# EAGLE design heartrate (EAGLE 7.4.0)
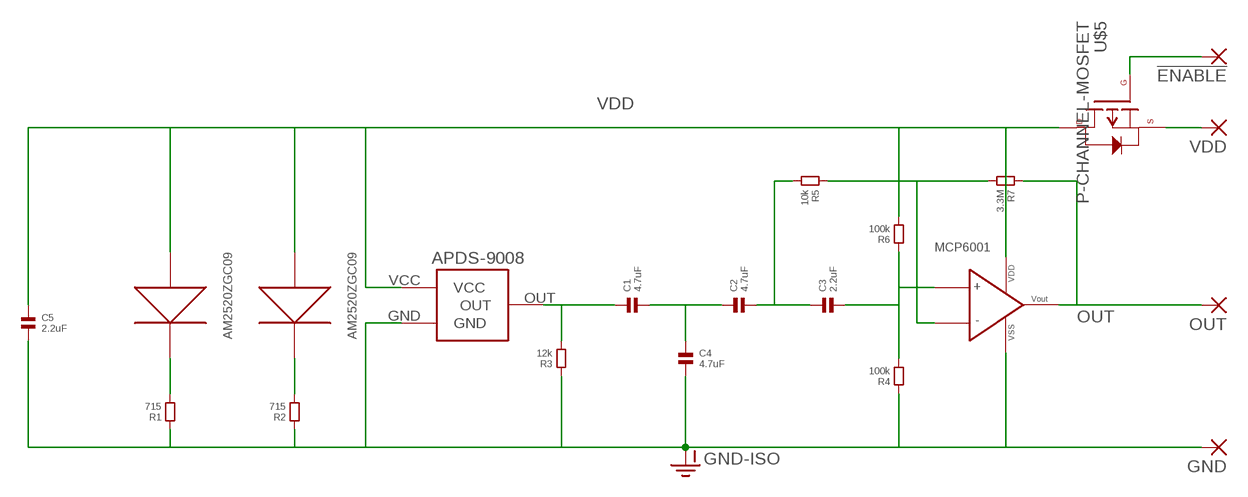
[diagram p0: schematic, sheet 1]

## Parts
!ENABLE  SMD2  [SMD1,27-2,54]
C1  4.7uF  CAPACITOR.0402  [0402]
C2  4.7uF  CAPACITOR.0402  [0402]
C3  2.2uF  CAPACITOR.0402  [0402]
C4  4.7uF  CAPACITOR.0402  [0402]
C5  2.2uF  CAPACITOR.0402  [0402]
GND  SMD2  [SMD1,27-2,54]
OUT  SMD2  [SMD1,27-2,54]
R1  715  RESISTOR.0402  [0402]
R2  715  RESISTOR.0402  [0402]
R3  12k  RESISTOR.0402  [0402]
R4  100k  RESISTOR.0402  [0402]
R5  10k  RESISTOR.0402  [0402]
R6  100k  RESISTOR.0402  [0402]
R7  3.3M  RESISTOR.0402  [0402]
U$1  DSAH3717  [DSAH3717]
U$2  DSAH3717  [DSAH3717]
U$3  APDS-9008  [APDS-9008]
U$4  MCP6001  [SOT23-5]
U$5  P-CHANNEL-MOSFET  [SOT23-3]
VDD  SMD2  [SMD1,27-2,54]

## Nets
GND: C4.2 C5.2 GND.1(P) R1.1 R2.1 R3.1 R4.1 U$3.GND U$4.VSS ; supply symbol labelled GND-ISO
N$1: R1.2 U$1.G(GND)
N$2: U$5.2(S) VDD.1(P)
N$3: !ENABLE.1(P) U$5.1(G)
N$4: R2.2 U$2.G(GND)
N$5: C1.1 R3.2 U$3.OUT
N$6: C1.2 C2.1 C4.1
N$7: C2.2 C3.1 R5.2
N$10: C3.2 R4.2 R6.1 U$4.VIN+
N$12: R5.1 R7.2 U$4.VIN-
OUT: OUT.1(P) R7.1 U$4.VOUT
VDD: C5.1 R6.2 U$1.V(VDD) U$2.V(VDD) U$3.VCC U$4.VDD U$5.3(D)

## Library data of the parts
!ENABLE GND OUT VDD = wirepad:SMD2: SMD PAD
C1-C5 = standardparts:CAPACITOR
R1-R7 = standardparts:RESISTOR
U$1 U$2 = MedStatCustom:DSAH3717
U$3 = MedStatCustom:APDS-9008
U$4 = MedStatCustom:MCP6001
U$5 = GeekAmmo:P-CHANNEL-MOSFET: P-Channel MOSFET Mode Field Effect Transistor

## Board
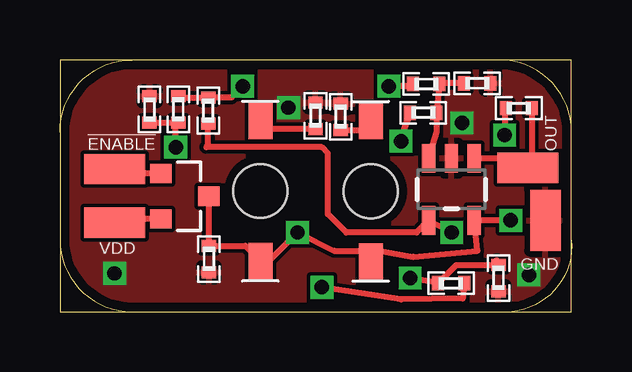
[diagram p1: board, top side]
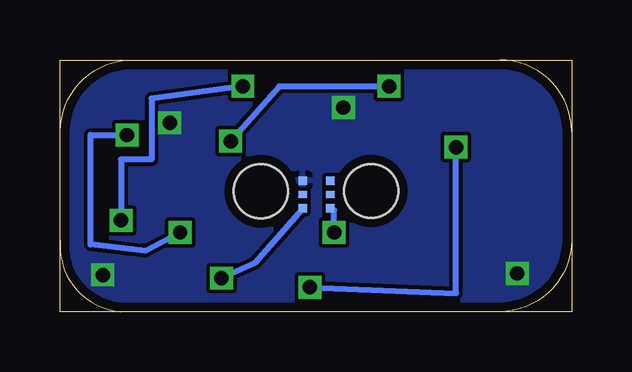
[diagram p2: board, bottom side, seen from below]

Size 21.34 x 10.5 mm. Coordinates in mm from the lower left corner, seen from the top.
Outline: 3,0 0,0 0,3
Outline: 3,0 18.84,0
Outline: 18.84,0 21.33,0 21.33,3
Outline: 21.33,3 21.33,7.5
Outline: 21.33,7.5 21.33,10.5 18.33,10.5
Outline: 18.33,10.5 3,10.5
Outline: 3,10.5 0,10.5 0,7.5
Outline: 0,7.5 0,3
Outline: 2.1,10.5 2,10.5
Outline: 0,3 arc90 3,0
Outline: 21.33,3 arc-90 18.84,0
Outline: 21.33,7.5 arc90 18.33,10.5
Outline: 0,7.5 arc-90 3,10.5
Copper layers (1*16): Top 0.0356mm / dielectric 1.5011mm / Bottom 0.0356mm
Design rules "oshpark-2layer": minimum track width 6mil, minimum drill 13mil, track to track 6mil, track to pad 6mil, pad to pad 6mil, via to via 6mil, smd to smd 6mil, copper to edge 15mil, drill to drill 6mil, minimum pad ring 7mil, minimum via ring 7mil, stop-mask expansion 4mil, vias tented up to drill 0mil, thermal gap 10mil

### Footprints (pad centres in the part's own frame; a part is rotated, then mirrored left to right if it is on the bottom)
SMD1,27-2,54 = smd 1.27 x 2.54: 1 0,0
0402 = smd 0.5 x 0.6: 1 -0.55,0; 2 0.55,0
DSAH3717 = smd 1.5 x 1: G 2.925,0; V -2.925,0 | hole 2.25: 0,0
APDS-9008 = smd 0.35 x 0.35: GND -0.575,-0.575; OUT 0.575,-0.575; P$6 -0.575,0.575; VCC 0.575,0.575 | smd 0.3 x 0.35: P$1 0,0.575; P$2 0,-0.575
SOT23-5 = smd 0.55 x 1.2: VDD -0.95,1.3; VIN+ 0.95,-1.3; VIN- 0.95,1.3; VOUT -0.95,-1.3; VSS 0,-1.3
SOT23-3 = smd 0.8 x 0.9: 1 -0.95,-1; 2 0.95,-1; 3 0,1

### Placement (x,y rotation side)
!ENABLE  2.28,5.95 270 top
C1  16.3,1.18 0 top
C2  4.93,8.44 90 top
C3  15.15,8.3 0 top
C4  3.73,8.44 90 top
C5  6.21,2.19 270 top
GND  20.24,3.8 180 top
OUT  19.52,5.99 90 top
R1  11.7,8.13 270 top
R2  10.66,8.17 270 top
R3  18.29,1.4 90 top
R4  17.4,9.53 180 top
R5  6.18,8.39 90 top
R6  15.28,9.5 180 top
R7  19.13,8.49 180 top
U$1  12.96,5.02 90 top
U$2  8.36,5.03 90 top
U$3  10.64,4.89 270 bottom
U$4  16.32,5.1 180 top
U$5  5.2,4.81 270 top
VDD  2.28,3.71 90 top

### Tracks (layer width: path | path; a pad name or v marks a point on that pad's centre or on a via)
GND  (via drill 0.6)
  other vias: 2.28,1.59 19.56,1.52 9.53,8.51 16.76,7.87
  pour Top: -0.4,10.8 -0.4,-0.6 23,-0.6 23,10.8
  pour Bottom: -0.7,11.3 23.5,11.3 23.5,-1.1 -0.7,-1.1
N$1
  Top 0.254: R1.2 12.96,7.58 U$1.G
N$2
  Top 0.254: U$5.2 2.28,3.86 VDD.1
N$3
  Top 0.254: U$5.1 2.28,5.76 !ENABLE.1
N$4
  Top 0.254: R2.2 8.36,7.62 U$2.G
N$5  (via drill 0.6)
  Top 0.254: v14.61,1.4 15.54,1.27 C1.1 16.52,1.95 R3.2 18.21,2.15
  Bottom 0.254: U$3.OUT 11.22,4.28 13.21,2.03 v14.61,1.4
N$6  (via drill 0.6)
  Top 0.254: C4.1 C2.1 4.83,7.78 v4.83,6.86 | C1.2 16.8,0.54 14.22,0.51 v10.92,1.02
  Bottom 0.254: v10.92,1.02 4.83,0.76 v4.83,6.86
N$7  (via drill 0.6)
  Top 0.254: C2.2 4.99,8.94 R5.2 7.16,8.94 v7.62,9.4 | C3.1 14.34,7.62 v14.22,7.11
  Bottom 0.254: v14.22,7.11 12.19,9.4 v7.62,9.4
N$10
  Top 0.254: R4.2 15.72,9.53 R6.1 C3.2 15.7,7.48 U$4.VIN+
N$12  (via drill 0.6)
  Top 0.254: R7.2 18.54,8.23 v18.54,7.37 | v16.33,3.3 U$4.VIN- | U$4.VIN- | U$4.VIN- 14.87,3.3 11.94,3.3 11.18,4.06 11.18,6.6 10.92,6.86 6.1,6.86 6.18,6.94 R5.1
  Bottom 0.254: v16.33,3.3 17.78,2.54 20.07,2.79 20.07,7.37 v18.54,7.37
OUT
  Top 0.254: R7.1 19.68,6.41 OUT.1 18.86,6.4 U$4.VOUT
VDD  (via drill 0.6)
  Top 0.254: U$5.3 C5.1 7.73,2.74 U$2.V 8.71,2.1 v9.91,3.3 11.43,2.54 12.7,2.54 12.7,2.36 U$1.V 13.02,2.6 14.73,2.29 17.41,2.54 U$4.VDD 18.78,3.8 v18.8,3.81 | R6.2 14.45,9.4 v13.72,9.4
  Bottom 0.254: v9.91,3.3 9.91,4.22 U$3.VCC | v13.72,9.4 17.53,8.89 17.53,6.35 18.8,6.35 v18.8,3.81